# Altium schematic sheet SCH_NAS.SchDoc
size B
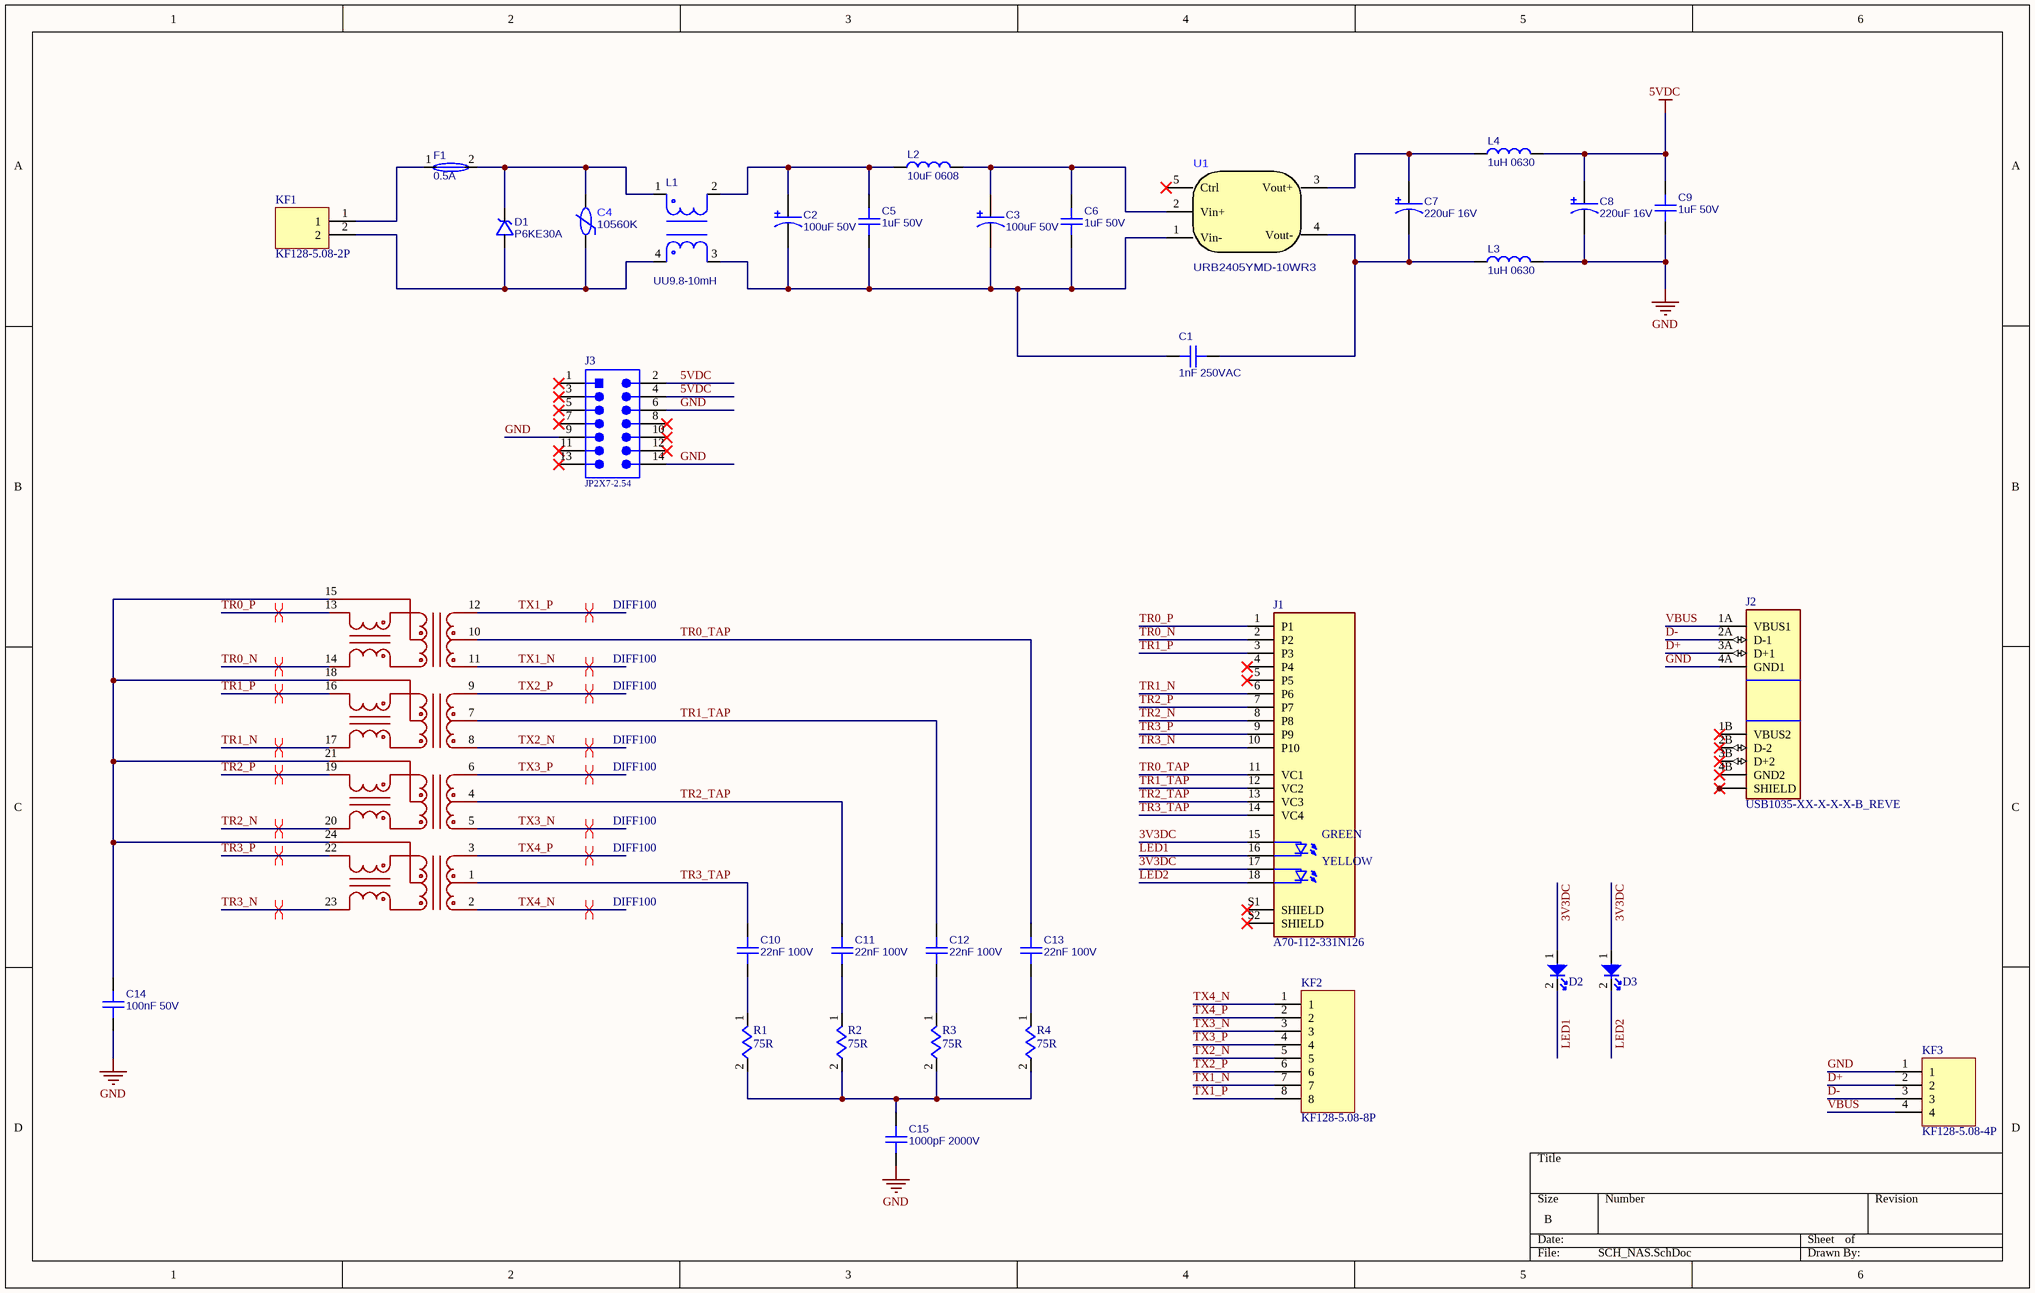
[diagram p0: SCH_NAS.SchDoc]

## Parts
C1  1nF 250VAC  [CAP CERRAMIC]
C2  100uF 50V  [Cap alum Hole TYPE D8]
C3  100uF 50V  [Cap alum Hole TYPE D8]
C4  10560K  [CAP VARISTOR HOLD 10D type 10mm]
C5  1uF 50V  [CAP CERRAMIC]
C6  1uF 50V  [CAP CERRAMIC]
C7  220uF 16V  [Cap alum Hole TYPE D6.3]
C8  220uF 16V  [Cap alum Hole TYPE D6.3]
C9  1uF 50V  [CAP CERRAMIC]
C10  22nF 100V  [CAP CERAMIC SMD 1210 TyPE 3225]
C11  22nF 100V  [CAP CERAMIC SMD 1210 TyPE 3225]
C12  22nF 100V  [CAP CERAMIC SMD 1210 TyPE 3225]
C13  22nF 100V  [CAP CERAMIC SMD 1210 TyPE 3225]
C14  100nF 50V  [CAP CERAMIC SMD 1206 TyPE 3216]
C15  1000pF 2000V  [CAP CERAMIC SMD 1210 TyPE 3225]
D1  P6KE30A  [DIode HOLD STAND DO-15 TYPE 2A]
D2  LED  [LED HOLD BLUE TYPE 3MM]  (value not drawn)
D3  LED  [LED HOLD BLUE TYPE 3MM]  (value not drawn)
F1  0.5A  [Fuses Resettable HOLd type 5mm]
J1  A70-112-331N126  [Taubien]
J2  USB1035-XX-X-X-X-B_REVE  [TAUBIEN2]
J3  JP2X7-2.54  [RASBERRY]
KF1  KF128-5.08-2P  [CONNECTORS SCREW TERMINAL KF128-5.08-2P]
KF2  KF128-5.08-8P  [CONNECTORS SCREW TERMINAL KF128-5.08-8P]
KF3  KF128-5.08-4P  [CONNECTORS SCREW TERMINAL KF128-5.08-4P]
L1  UU9.8-10mH  [COMMON MODE FILTERS UU9.8]
L2  10uF 0608  [INDUCTOS POWER HOLD 0608]
L3  1uH 0630  [INDUCTORS SMD 0630]
L4  1uH 0630  [INDUCTORS SMD 0630]
L5  G2401CE  [TRANSFORMER G2401CE]  (value not drawn)
R1  75R  [RES CHIPS SMD 1206 TYPE 3216]
R2  75R  [RES CHIPS SMD 1206 TYPE 3216]
R3  75R  [RES CHIPS SMD 1206 TYPE 3216]
R4  75R  [RES CHIPS SMD 1206 TYPE 3216]
U1  URB2405YMD-10WR3  [MODULES POWER URB2405YMD-10WR3]

## Nets
5VDC: C8.1 C9.2 J3.2 J3.4 L4.2
GND: C8.2 C9.1 C14.1 C15.1 J2.4A(GND1) J3.6 J3.9 J3.14 KF3.1 L3.2
3V3DC: D2.1 D3.1 J1.15(G_A) J1.17(Y_A)
D+: J2.3A(D+1) KF3.2
D-: J2.2A(D-1) KF3.3
LED1: D2.2 J1.16(G_K)
LED2: D3.2 J1.18(Y_K)
TR0_N: J1.2(P2) L5.14
TR0_P: J1.1(P1) L5.13
TR0_TAP: C13.2 J1.11(VC1) L5.10
TR1_N: J1.6(P6) L5.17
TR1_P: J1.3(P3) L5.16
TR1_TAP: C12.2 J1.12(VC2) L5.7
TR2_N: J1.8(P8) L5.20
TR2_P: J1.7(P7) L5.19
TR2_TAP: C11.2 J1.13(VC3) L5.4
TR3_N: J1.10(P10) L5.23
TR3_P: J1.9(P9) L5.22
TR3_TAP: C10.2 J1.14(VC4) L5.1
TX1_N: KF2.7 L5.11
TX1_P: KF2.8 L5.12
TX2_N: KF2.5 L5.8
TX2_P: KF2.6 L5.9
TX3_N: KF2.3 L5.5
TX3_P: KF2.4 L5.6
TX4_N: KF2.1 L5.2
TX4_P: KF2.2 L5.3
VBUS: J2.1A(VBUS1) KF3.4
NetC1_1: C1.1 C7.2 L3.1 U1.4(Vout-)
NetC1_2: C1.2 C2.2 C3.2 C5.1 C6.1 L1.3 U1.1(Vin-)
NetC2_1: C2.1 C5.2 L1.2 L2.1
NetC3_1: C3.1 C6.2 L2.2 U1.2(Vin+)
NetC4_1: C4.1 D1.1(A) KF1.2 L1.4
NetC4_2: C4.2 D1.2(K) F1.2 L1.1
NetC7_1: C7.1 L4.1 U1.3(Vout+)
NetC10_1: C10.1 R1.1
NetC11_1: C11.1 R2.1
NetC12_1: C12.1 R3.1
NetC13_1: C13.1 R4.1
NetC14_2: C14.2 L5.15 L5.18 L5.21 L5.24
NetC15_2: C15.2 R1.2 R2.2 R3.2 R4.2
NetF1_1: F1.1 KF1.1
NetJ2_9: J2.9(SHIELD) J2.10(SHIELD) J2.11(SHIELD) J2.12(SHIELD)

Not connected (* = marked no-connect by the designer): J1 4(P4)* 5(P5)* S1(SHIELD)* S2(SHIELD)*; J2 1B(VBUS2)* 2B(D-2)* 3B(D+2)* 4B(GND2)*; J3 1* 3* 5* 7* 8* 10* 11* 12* 13*; U1 5(Ctrl)*

## Layout directives
differential pair; net class DIFF100: TR0_N, TR0_P, TR1_N, TR1_P, TR2_N, TR2_P, TR3_N, TR3_P, TX1_N, TX1_P, TX2_N, TX2_P, TX3_N, TX3_P, TX4_N, TX4_P

## Notes on the sheet
- (in symbol A70-112-331N126) GREEN; YELLOW

## Library data of the parts
C1 C5 C6 C9-C15 = CAP CBB HOLD: 10nF ±5% 1kV Plugin,P=10mm Polypropylene Film Capacitors (CBB) ROHS; BOM_Manufacturer: faratronic(厦门法拉); BOM_Manufacturer Part: C313A103J4SC000; Contributor: LCSC; nameAlias: Capacitance; BOM_Supplier: LCSC; BOM_Supplier Part: C783642; BOM_JLCPCB Part Class: Extended Part; spicePre: C; spiceSymbolName: C313A103J4SC000
C2 C3 C7 C8 = CAP ALU HOLD: Aluminum Electrolytic Capacitors - Leaded ROHS; BOM_Manufacturer: AISHI(艾华集团); BOM_Manufacturer Part: ERR1VM102G20OT; nameAlias: Capacitance; Contributor: LCSC; BOM_Supplier: LCSC; BOM_Supplier Part: C398835; BOM_JLCPCB Part Class: Extended Part; spicePre: C; spiceSymbolName: ERR1VM102G20OT
C4 = CAP VARISTOR HOLD 10D471K
D1 = DIODE ZENER SMD MMSZ5231BT1G: 5uA@2V ±5% 17Ω Single 4.85V~5.36V 500mW 5.1V SOD-123 Zener Diodes ROHS; BOM_Manufacturer: onsemi(安森美); BOM_Supplier: LCSC; BOM_Manufacturer Part: MMSZ5231BT1G; BOM_Supplier Part: C66198; BOM_JLCPCB Part Class: Extended Part; spicePre: D; spiceSymbolName: MMSZ5231BT1G
D2 D3 = LED SMD 0805: Emerald 0805 Light Emitting Diodes (LED) ROHS; Supplier 1: RSComponents
F1 = FUSE RESETTABLE HOLD TYPE 5MM: FUSE RECOVERY ROHS; BOM_Manufacturer: SEMBO(深波); BOM_Manufacturer Part: 1812-200/8V; Contributor: lcsc; BOM_Supplier: LCSC; BOM_Supplier Part: C782775; BOM_JLCPCB Part Class: Extended Part; spicePre: F; spiceSymbolName: 1812-200/8V
J1 = A70-112-331N126: RJ45 MAGNETIC JACK WITH LED; Package: None; Availability: Unavailable; MP: A70-112-331N126; Value: *; Price: None
J2 = USB1035-XX-X-X-X-B_REVE: USB-A (USB TYPE-A), Stacked USB 2.0 Receptacle Connector 8 Position Through Hole, Right Angle; MP: USB1035-GF-P-0-B-B; MF: Global Connector Technology; Purchase-URL: https://pricing.snapeda.com/search/part/USB1035-GF-P-0-B-B/?ref=eda; SnapEDA_Link: https://www.snapeda.com/parts/USB1035-GF-P-0-B-B/Global+Connector+Technology/view-part/?ref=snap; Availability: In Stock; Check_prices: https://www.snapeda.com/parts/USB1035-GF-P-0-B-B/Global+Connector+Technology/view-part/?ref=eda; Package: None; Value: *; Price: None
J3 = CONNECTORS FEMALE HEADERS 2X7 2.54: WR-PHD Pin Header, THT, pitch 2.54mm, Dual Row, Angled, 14p; Manufacturer Part Number: 61301421021; Manufacturer: Wurth Elektronik; Pin Number: 14; Rated Current: 3A; Working Voltage: 250VAC; Withstanding Voltage: 500VAC; Contact Resistance: 20mOhm; ComponentLink1Description: Manufacturer; ComponentLink1URL: http://www.we-online.de; ComponentLink2Description: Datasheet; ComponentLink2URL: https://www.we-online.com/catalog/datasheet/61301421021.pdf; Pitch: 2.54mm; Operating Temperature: -40 to +105degC; Mounting Technology: THT; Packaging: Bag; Gender: Pin Header; Row Number: Dual; Orientation: Angled
KF1 = CONNECTORS SCREW TERMINAL KF128-5.08-2P: 2~24 Poles, Screw Type, Horizontal, 5.08 Pitch, 24~12 _AWG_, Terminal Block Connector; MF: CUI Devices; MP: TB004-508-02GR; Availability: Unavailable; CUI_purchase_URL: https://www.cuidevices.com/product/interconnect/connectors/terminal-blocks/tb004-508-series?utm_source=snapeda.com&utm_medium=referral&utm_campaign=snapedaBOM; Value: *; SnapEDA_Link: https://www.snapeda.com/parts/TB004-508-02GR/CUI%20Devices/view-part/3590869/?ref=snap; Price: None; Package: None
KF2 = CONNECTORS SCREW TERMINAL KF128-5.08-8P: 2~24 Poles, Screw Type, Horizontal, 5.08 Pitch, 24~12 _AWG_, Terminal Block Connector; MP: TB004-508-08GR; Price: None; Availability: Unavailable; Value: *; Package: None
KF3 = CONNECTORS SCREW TERMINAL KF128-5.08-4P: 2~24 Poles, Screw Type, Horizontal, 5.08 Pitch, 24~12 _AWG_, Terminal Block Connector; MP: TB004-508-04GR; Package: None; Price: None; Value: *; Availability: Unavailable
L1 = COMMON MODE FILTERS UU9.8: Common Mode Filters ROHS; BOM_Manufacturer: Guangdong Fenghua Advanced Tech; BOM_Manufacturer Part: UU9.8-5mH; nameAlias: Value; Contributor: LCSC; BOM_Supplier: LCSC; BOM_Supplier Part: C116373; BOM_JLCPCB Part Class: Extended Part; spicePre: L; spiceSymbolName: UU9.8-5MH; Supplier 1: Future Electronics; Supplier Part Number 1: UU9LFNP-B102-TRAY
L2-L4 = INDUCTORS SMD: BOM_Manufacturer: Yanchuang(研创); BOM_Manufacturer Part: SCHF160808H47NJT; nameAlias: Inductance; Contributor: LCSC; BOM_Supplier: LCSC; BOM_Supplier Part: C578001; BOM_JLCPCB Part Class: Extended Part; spicePre: L; spiceSymbolName: SCHF160808H47NJT
L5 = G2401CE: Manufacturer: Mentech(铭普光磁); Add into BOM: yes; Symbol: G2401CE; Device: G2401CE; LCSC Part Name: G2401CE; Supplier Part: C2904710; Manufacturer Part: G2401CE; Supplier Footprint: SMD-24P,15.1x7.1mm; JLCPCB Part Class: Extended Part; Datasheet: https://atta.szlcsc.com/upload/public/pdf/source/20211025/95DB28D2FF909A70F6FA65CA337621A6.pdf; Supplier: LCSC; Convert to PCB: yes; Comment_1: G2401CE
R1-R4 = RES 0603 1%_: ±1% - Chip Resistor - Surface Mount ROHS; Chung_Loai: Dán; Don_Vi: Con; So_Chan: 2; Ma_Hang: MH005880; Kieu_Chan: *
U1 = Modules power URB2405YMD-10WR3